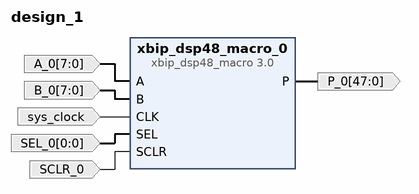
[diagram p0: block diagram of the top level]
# Vivado block design design_1, xc7z010clg400-1, Vivado 2017.3
create_bd_design design_1

create_bd_port -dir I -from 7 -to 0 -type data A_0
create_bd_port -dir I -from 7 -to 0 -type data B_0
create_bd_port -dir I -type clk sys_clock
set_property -dict {CONFIG.FREQ_HZ 125000000 CONFIG.PHASE 0.000} [get_bd_ports sys_clock]
create_bd_port -dir I -from 0 -to 0 -type data SEL_0
create_bd_port -dir O -from 47 -to 0 -type data P_0
create_bd_port -dir I -type rst SCLR_0
set_property -dict {CONFIG.POLARITY ACTIVE_HIGH} [get_bd_ports SCLR_0]

create_bd_cell -type ip -vlnv xilinx.com:ip:xbip_dsp48_macro:3.0 xbip_dsp48_macro_0
set_property -dict [list \
  CONFIG.instruction1 {A*B+P} \
  CONFIG.instruction2 {A*B} \
  CONFIG.pipeline_options By_Tier \
  CONFIG.tier_6 true \
  CONFIG.dreg_3 false \
  CONFIG.areg_3 false \
  CONFIG.areg_4 false \
  CONFIG.breg_3 false \
  CONFIG.breg_4 false \
  CONFIG.creg_3 false \
  CONFIG.creg_4 false \
  CONFIG.creg_5 false \
  CONFIG.opreg_3 false \
  CONFIG.opreg_4 false \
  CONFIG.opreg_5 false \
  CONFIG.mreg_5 false \
  CONFIG.preg_6 true \
  CONFIG.d_width 18 \
  CONFIG.a_width 8 \
  CONFIG.a_binarywidth 0 \
  CONFIG.b_width 8 \
  CONFIG.b_binarywidth 0 \
  CONFIG.concat_width 48 \
  CONFIG.concat_binarywidth 0 \
  CONFIG.c_binarywidth 0 \
  CONFIG.pcin_binarywidth 0 \
  CONFIG.output_properties Full_Precision \
  CONFIG.p_full_width 48 \
  CONFIG.p_width 48 \
  CONFIG.p_binarywidth 0 \
  CONFIG.has_carryout false \
  CONFIG.has_acout false \
  CONFIG.has_bcout false \
  CONFIG.has_carrycascout false \
  CONFIG.has_pcout false \
  CONFIG.has_sclr true \
] [get_bd_cells xbip_dsp48_macro_0]

# ---- connections ----

connect_bd_net -net A_0_1 [get_bd_ports A_0] [get_bd_pins xbip_dsp48_macro_0/A]
connect_bd_net -net B_0_1 [get_bd_ports B_0] [get_bd_pins xbip_dsp48_macro_0/B]
connect_bd_net [get_bd_ports sys_clock] [get_bd_pins xbip_dsp48_macro_0/CLK]
connect_bd_net -net SEL_0_1 [get_bd_ports SEL_0] [get_bd_pins xbip_dsp48_macro_0/SEL]
connect_bd_net [get_bd_pins xbip_dsp48_macro_0/P] [get_bd_ports P_0]
connect_bd_net -net SCLR_0_1 [get_bd_ports SCLR_0] [get_bd_pins xbip_dsp48_macro_0/SCLR]

validate_bd_design
save_bd_design
